# Altium schematic sheet RGBM-06.SchDoc
size Tabloid; SheetNumber: 6; SheetTotal: 7
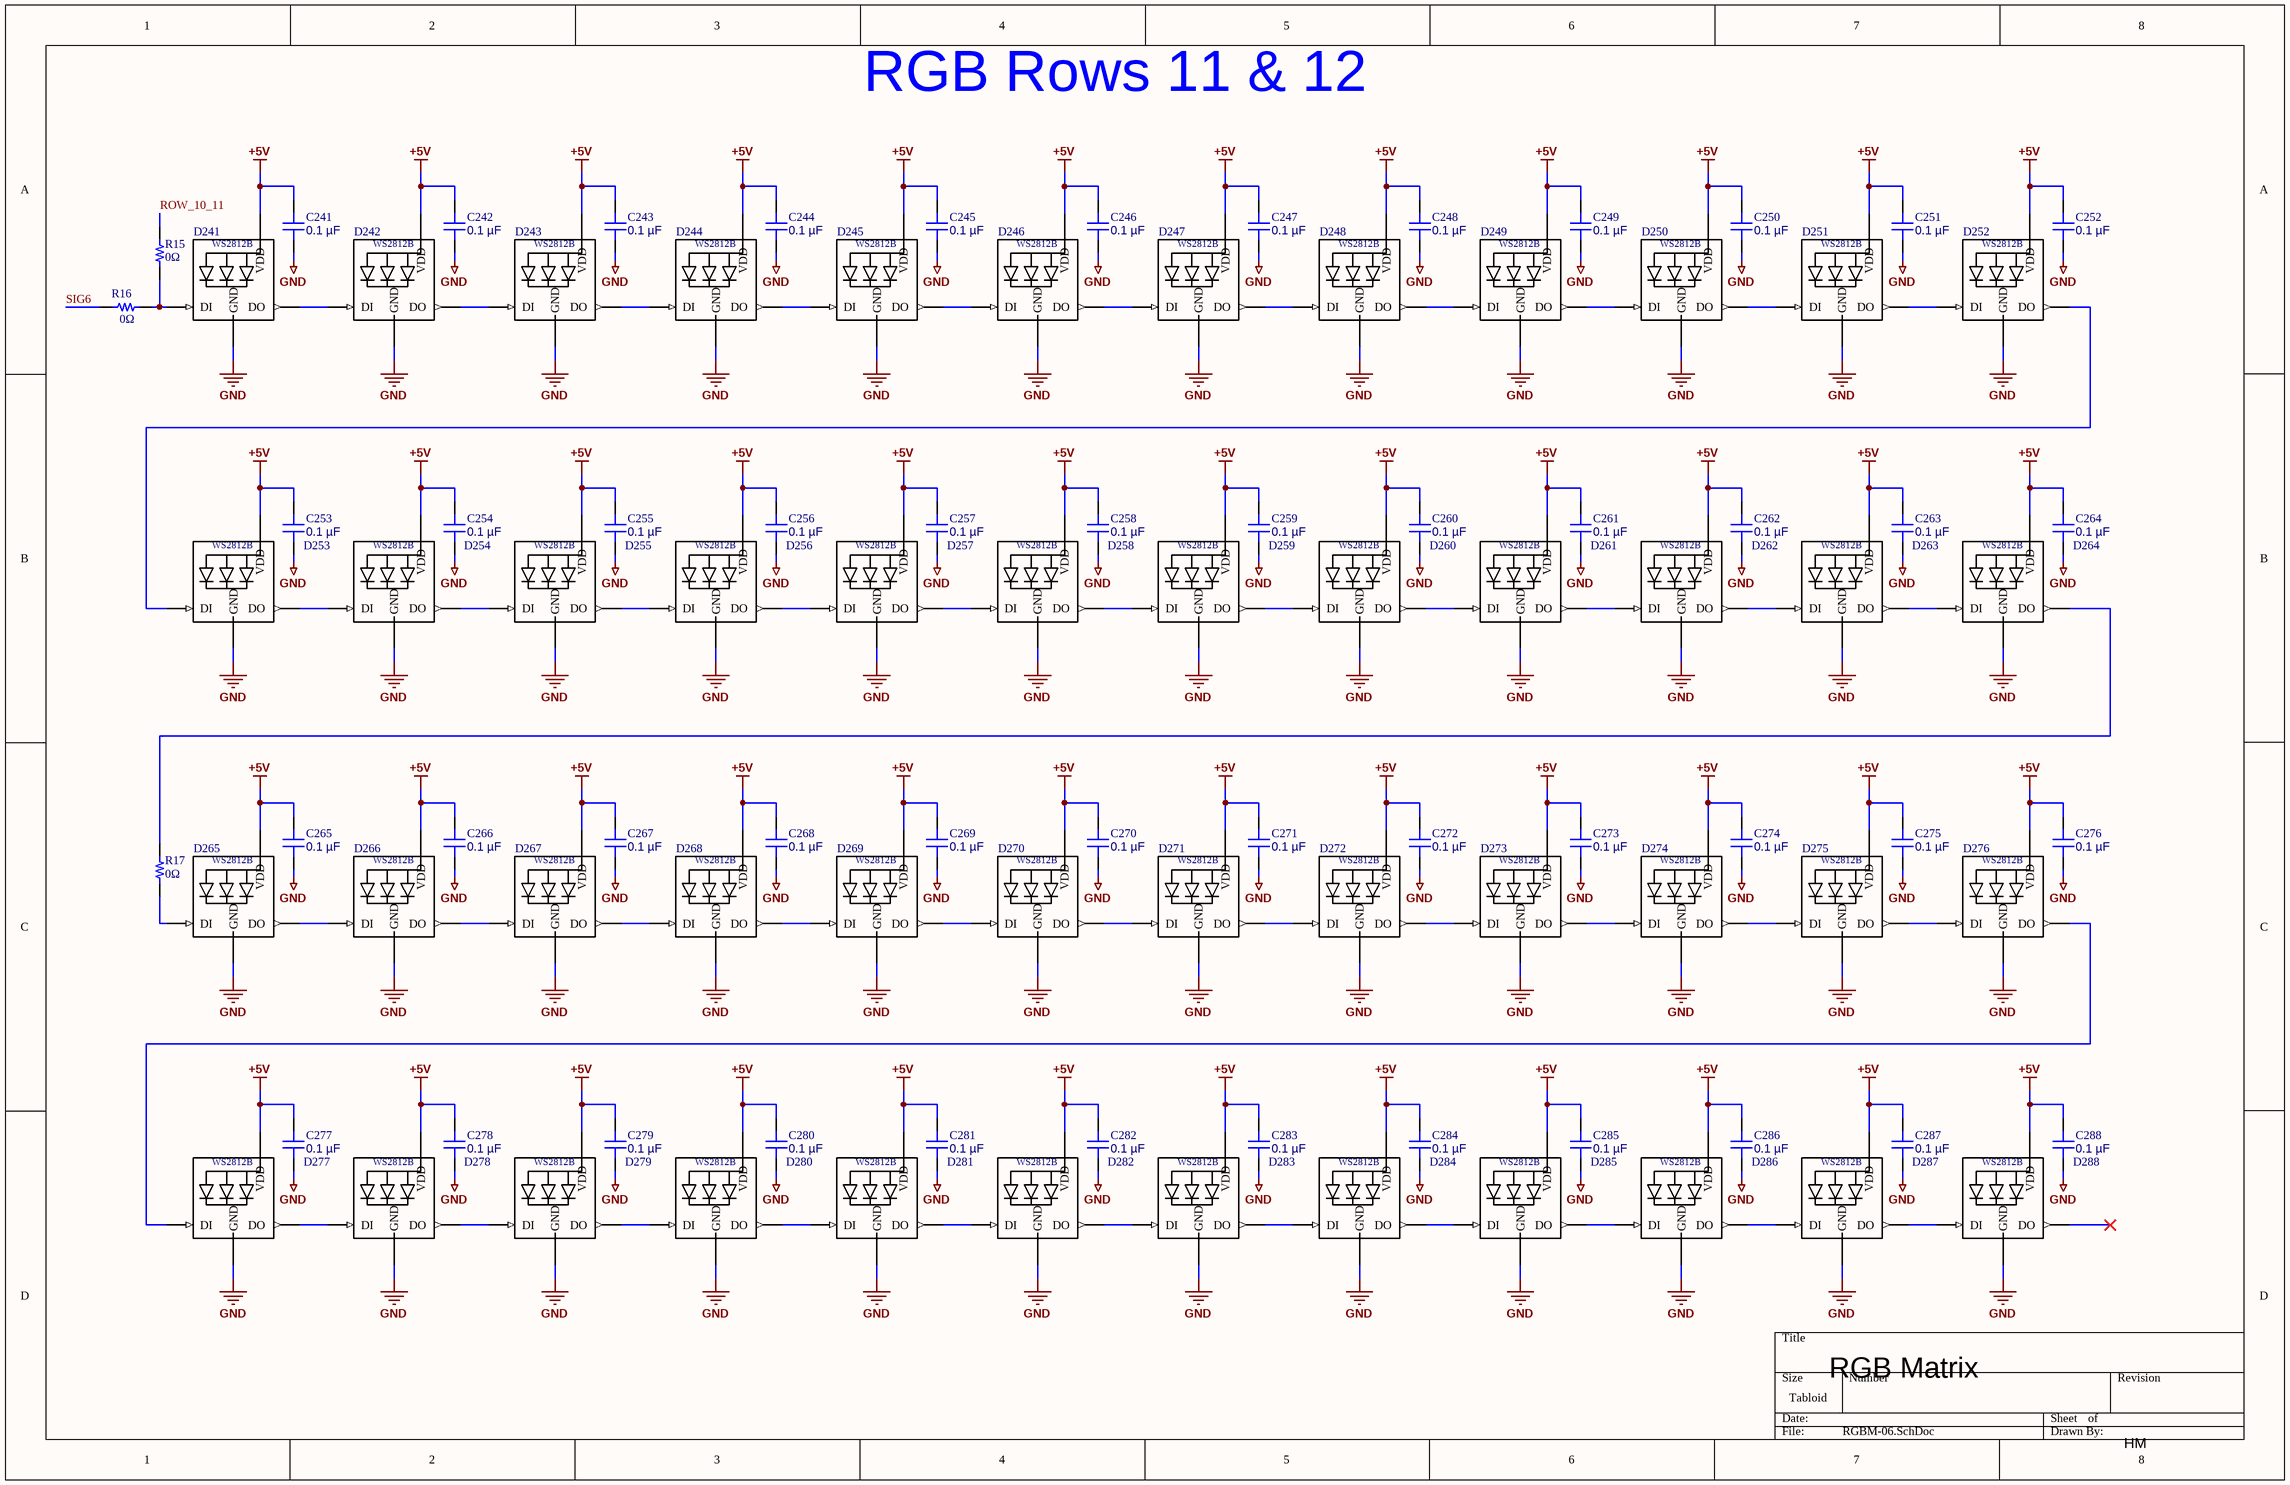
[diagram p0: RGBM-06.SchDoc]

## Parts
C241  0.1 µF  [CAP 0603_1608]
C242  0.1 µF  [CAP 0603_1608]
C243  0.1 µF  [CAP 0603_1608]
C244  0.1 µF  [CAP 0603_1608]
C245  0.1 µF  [CAP 0603_1608]
C246  0.1 µF  [CAP 0603_1608]
C247  0.1 µF  [CAP 0603_1608]
C248  0.1 µF  [CAP 0603_1608]
C249  0.1 µF  [CAP 0603_1608]
C250  0.1 µF  [CAP 0603_1608]
C251  0.1 µF  [CAP 0603_1608]
C252  0.1 µF  [CAP 0603_1608]
C253  0.1 µF  [CAP 0603_1608]
C254  0.1 µF  [CAP 0603_1608]
C255  0.1 µF  [CAP 0603_1608]
C256  0.1 µF  [CAP 0603_1608]
C257  0.1 µF  [CAP 0603_1608]
C258  0.1 µF  [CAP 0603_1608]
C259  0.1 µF  [CAP 0603_1608]
C260  0.1 µF  [CAP 0603_1608]
C261  0.1 µF  [CAP 0603_1608]
C262  0.1 µF  [CAP 0603_1608]
C263  0.1 µF  [CAP 0603_1608]
C264  0.1 µF  [CAP 0603_1608]
C265  0.1 µF  [CAP 0603_1608]
C266  0.1 µF  [CAP 0603_1608]
C267  0.1 µF  [CAP 0603_1608]
C268  0.1 µF  [CAP 0603_1608]
C269  0.1 µF  [CAP 0603_1608]
C270  0.1 µF  [CAP 0603_1608]
C271  0.1 µF  [CAP 0603_1608]
C272  0.1 µF  [CAP 0603_1608]
C273  0.1 µF  [CAP 0603_1608]
C274  0.1 µF  [CAP 0603_1608]
C275  0.1 µF  [CAP 0603_1608]
C276  0.1 µF  [CAP 0603_1608]
C277  0.1 µF  [CAP 0603_1608]
C278  0.1 µF  [CAP 0603_1608]
C279  0.1 µF  [CAP 0603_1608]
C280  0.1 µF  [CAP 0603_1608]
C281  0.1 µF  [CAP 0603_1608]
C282  0.1 µF  [CAP 0603_1608]
C283  0.1 µF  [CAP 0603_1608]
C284  0.1 µF  [CAP 0603_1608]
C285  0.1 µF  [CAP 0603_1608]
C286  0.1 µF  [CAP 0603_1608]
C287  0.1 µF  [CAP 0603_1608]
C288  0.1 µF  [CAP 0603_1608]
D241  WS2812B  [*WS2812B_WS2812B(Primary)]  (value not drawn)
D242  WS2812B  [*WS2812B_WS2812B(Primary)]  (value not drawn)
D243  WS2812B  [*WS2812B_WS2812B(Primary)]  (value not drawn)
D244  WS2812B  [*WS2812B_WS2812B(Primary)]  (value not drawn)
D245  WS2812B  [*WS2812B_WS2812B(Primary)]  (value not drawn)
D246  WS2812B  [*WS2812B_WS2812B(Primary)]  (value not drawn)
D247  WS2812B  [*WS2812B_WS2812B(Primary)]  (value not drawn)
D248  WS2812B  [*WS2812B_WS2812B(Primary)]  (value not drawn)
D249  WS2812B  [*WS2812B_WS2812B(Primary)]  (value not drawn)
D250  WS2812B  [*WS2812B_WS2812B(Primary)]  (value not drawn)
D251  WS2812B  [*WS2812B_WS2812B(Primary)]  (value not drawn)
D252  WS2812B  [*WS2812B_WS2812B(Primary)]  (value not drawn)
D253  WS2812B  [*WS2812B_WS2812B(Primary)]  (value not drawn)
D254  WS2812B  [*WS2812B_WS2812B(Primary)]  (value not drawn)
D255  WS2812B  [*WS2812B_WS2812B(Primary)]  (value not drawn)
D256  WS2812B  [*WS2812B_WS2812B(Primary)]  (value not drawn)
D257  WS2812B  [*WS2812B_WS2812B(Primary)]  (value not drawn)
D258  WS2812B  [*WS2812B_WS2812B(Primary)]  (value not drawn)
D259  WS2812B  [*WS2812B_WS2812B(Primary)]  (value not drawn)
D260  WS2812B  [*WS2812B_WS2812B(Primary)]  (value not drawn)
D261  WS2812B  [*WS2812B_WS2812B(Primary)]  (value not drawn)
D262  WS2812B  [*WS2812B_WS2812B(Primary)]  (value not drawn)
D263  WS2812B  [*WS2812B_WS2812B(Primary)]  (value not drawn)
D264  WS2812B  [*WS2812B_WS2812B(Primary)]  (value not drawn)
D265  WS2812B  [*WS2812B_WS2812B(Primary)]  (value not drawn)
D266  WS2812B  [*WS2812B_WS2812B(Primary)]  (value not drawn)
D267  WS2812B  [*WS2812B_WS2812B(Primary)]  (value not drawn)
D268  WS2812B  [*WS2812B_WS2812B(Primary)]  (value not drawn)
D269  WS2812B  [*WS2812B_WS2812B(Primary)]  (value not drawn)
D270  WS2812B  [*WS2812B_WS2812B(Primary)]  (value not drawn)
D271  WS2812B  [*WS2812B_WS2812B(Primary)]  (value not drawn)
D272  WS2812B  [*WS2812B_WS2812B(Primary)]  (value not drawn)
D273  WS2812B  [*WS2812B_WS2812B(Primary)]  (value not drawn)
D274  WS2812B  [*WS2812B_WS2812B(Primary)]  (value not drawn)
D275  WS2812B  [*WS2812B_WS2812B(Primary)]  (value not drawn)
D276  WS2812B  [*WS2812B_WS2812B(Primary)]  (value not drawn)
D277  WS2812B  [*WS2812B_WS2812B(Primary)]  (value not drawn)
D278  WS2812B  [*WS2812B_WS2812B(Primary)]  (value not drawn)
D279  WS2812B  [*WS2812B_WS2812B(Primary)]  (value not drawn)
D280  WS2812B  [*WS2812B_WS2812B(Primary)]  (value not drawn)
D281  WS2812B  [*WS2812B_WS2812B(Primary)]  (value not drawn)
D282  WS2812B  [*WS2812B_WS2812B(Primary)]  (value not drawn)
D283  WS2812B  [*WS2812B_WS2812B(Primary)]  (value not drawn)
D284  WS2812B  [*WS2812B_WS2812B(Primary)]  (value not drawn)
D285  WS2812B  [*WS2812B_WS2812B(Primary)]  (value not drawn)
D286  WS2812B  [*WS2812B_WS2812B(Primary)]  (value not drawn)
D287  WS2812B  [*WS2812B_WS2812B(Primary)]  (value not drawn)
D288  WS2812B  [*WS2812B_WS2812B(Primary)]  (value not drawn)
R15  0Ω  [RES 0603_1608]
R16  0Ω  [RES 0603_1608]
R17  0Ω  [RES 0603_1608]

## Nets
+5V: C241.2 C242.2 C243.2 C244.2 C245.2 C246.2 C247.2 C248.2 C249.2 C250.2 C251.2 C252.2 C253.2 C254.2 C255.2 C256.2 C257.2 C258.2 C259.2 C260.2 C261.2 C262.2 C263.2 C264.2 C265.2 C266.2 C267.2 C268.2 C269.2 C270.2 C271.2 C272.2 C273.2 C274.2 C275.2 C276.2 C277.2 C278.2 C279.2 C280.2 C281.2 C282.2 C283.2 C284.2 C285.2 C286.2 C287.2 C288.2 D241.1-VDD(VDD) D242.1-VDD(VDD) D243.1-VDD(VDD) D244.1-VDD(VDD) D245.1-VDD(VDD) D246.1-VDD(VDD) D247.1-VDD(VDD) D248.1-VDD(VDD) D249.1-VDD(VDD) D250.1-VDD(VDD) D251.1-VDD(VDD) D252.1-VDD(VDD) D253.1-VDD(VDD) D254.1-VDD(VDD) D255.1-VDD(VDD) D256.1-VDD(VDD) D257.1-VDD(VDD) D258.1-VDD(VDD) D259.1-VDD(VDD) D260.1-VDD(VDD) D261.1-VDD(VDD) D262.1-VDD(VDD) D263.1-VDD(VDD) D264.1-VDD(VDD) D265.1-VDD(VDD) D266.1-VDD(VDD) D267.1-VDD(VDD) D268.1-VDD(VDD) D269.1-VDD(VDD) D270.1-VDD(VDD) D271.1-VDD(VDD) D272.1-VDD(VDD) D273.1-VDD(VDD) D274.1-VDD(VDD) D275.1-VDD(VDD) D276.1-VDD(VDD) D277.1-VDD(VDD) D278.1-VDD(VDD) D279.1-VDD(VDD) D280.1-VDD(VDD) D281.1-VDD(VDD) D282.1-VDD(VDD) D283.1-VDD(VDD) D284.1-VDD(VDD) D285.1-VDD(VDD) D286.1-VDD(VDD) D287.1-VDD(VDD) D288.1-VDD(VDD)
GND: C241.1 C242.1 C243.1 C244.1 C245.1 C246.1 C247.1 C248.1 C249.1 C250.1 C251.1 C252.1 C253.1 C254.1 C255.1 C256.1 C257.1 C258.1 C259.1 C260.1 C261.1 C262.1 C263.1 C264.1 C265.1 C266.1 C267.1 C268.1 C269.1 C270.1 C271.1 C272.1 C273.1 C274.1 C275.1 C276.1 C277.1 C278.1 C279.1 C280.1 C281.1 C282.1 C283.1 C284.1 C285.1 C286.1 C287.1 C288.1 D241.3-GND(GND) D242.3-GND(GND) D243.3-GND(GND) D244.3-GND(GND) D245.3-GND(GND) D246.3-GND(GND) D247.3-GND(GND) D248.3-GND(GND) D249.3-GND(GND) D250.3-GND(GND) D251.3-GND(GND) D252.3-GND(GND) D253.3-GND(GND) D254.3-GND(GND) D255.3-GND(GND) D256.3-GND(GND) D257.3-GND(GND) D258.3-GND(GND) D259.3-GND(GND) D260.3-GND(GND) D261.3-GND(GND) D262.3-GND(GND) D263.3-GND(GND) D264.3-GND(GND) D265.3-GND(GND) D266.3-GND(GND) D267.3-GND(GND) D268.3-GND(GND) D269.3-GND(GND) D270.3-GND(GND) D271.3-GND(GND) D272.3-GND(GND) D273.3-GND(GND) D274.3-GND(GND) D275.3-GND(GND) D276.3-GND(GND) D277.3-GND(GND) D278.3-GND(GND) D279.3-GND(GND) D280.3-GND(GND) D281.3-GND(GND) D282.3-GND(GND) D283.3-GND(GND) D284.3-GND(GND) D285.3-GND(GND) D286.3-GND(GND) D287.3-GND(GND) D288.3-GND(GND)
ROW_10_11: R15.2
SIG6: R16.1
NetD241_2-DOUT: D241.2-DOUT(DO) D242.4-DIN(DI)
NetD241_4-DIN: D241.4-DIN(DI) R15.1 R16.2
NetD242_2-DOUT: D242.2-DOUT(DO) D243.4-DIN(DI)
NetD243_2-DOUT: D243.2-DOUT(DO) D244.4-DIN(DI)
NetD244_2-DOUT: D244.2-DOUT(DO) D245.4-DIN(DI)
NetD245_2-DOUT: D245.2-DOUT(DO) D246.4-DIN(DI)
NetD246_2-DOUT: D246.2-DOUT(DO) D247.4-DIN(DI)
NetD247_2-DOUT: D247.2-DOUT(DO) D248.4-DIN(DI)
NetD248_2-DOUT: D248.2-DOUT(DO) D249.4-DIN(DI)
NetD249_2-DOUT: D249.2-DOUT(DO) D250.4-DIN(DI)
NetD250_2-DOUT: D250.2-DOUT(DO) D251.4-DIN(DI)
NetD251_2-DOUT: D251.2-DOUT(DO) D252.4-DIN(DI)
NetD252_2-DOUT: D252.2-DOUT(DO) D253.4-DIN(DI)
NetD253_2-DOUT: D253.2-DOUT(DO) D254.4-DIN(DI)
NetD254_2-DOUT: D254.2-DOUT(DO) D255.4-DIN(DI)
NetD255_2-DOUT: D255.2-DOUT(DO) D256.4-DIN(DI)
NetD256_2-DOUT: D256.2-DOUT(DO) D257.4-DIN(DI)
NetD257_2-DOUT: D257.2-DOUT(DO) D258.4-DIN(DI)
NetD258_2-DOUT: D258.2-DOUT(DO) D259.4-DIN(DI)
NetD259_2-DOUT: D259.2-DOUT(DO) D260.4-DIN(DI)
NetD260_2-DOUT: D260.2-DOUT(DO) D261.4-DIN(DI)
NetD261_2-DOUT: D261.2-DOUT(DO) D262.4-DIN(DI)
NetD262_2-DOUT: D262.2-DOUT(DO) D263.4-DIN(DI)
NetD263_2-DOUT: D263.2-DOUT(DO) D264.4-DIN(DI)
NetD264_2-DOUT: D264.2-DOUT(DO) R17.2
NetD265_2-DOUT: D265.2-DOUT(DO) D266.4-DIN(DI)
NetD265_4-DIN: D265.4-DIN(DI) R17.1
NetD266_2-DOUT: D266.2-DOUT(DO) D267.4-DIN(DI)
NetD267_2-DOUT: D267.2-DOUT(DO) D268.4-DIN(DI)
NetD268_2-DOUT: D268.2-DOUT(DO) D269.4-DIN(DI)
NetD269_2-DOUT: D269.2-DOUT(DO) D270.4-DIN(DI)
NetD270_2-DOUT: D270.2-DOUT(DO) D271.4-DIN(DI)
NetD271_2-DOUT: D271.2-DOUT(DO) D272.4-DIN(DI)
NetD272_2-DOUT: D272.2-DOUT(DO) D273.4-DIN(DI)
NetD273_2-DOUT: D273.2-DOUT(DO) D274.4-DIN(DI)
NetD274_2-DOUT: D274.2-DOUT(DO) D275.4-DIN(DI)
NetD275_2-DOUT: D275.2-DOUT(DO) D276.4-DIN(DI)
NetD276_2-DOUT: D276.2-DOUT(DO) D277.4-DIN(DI)
NetD277_2-DOUT: D277.2-DOUT(DO) D278.4-DIN(DI)
NetD278_2-DOUT: D278.2-DOUT(DO) D279.4-DIN(DI)
NetD279_2-DOUT: D279.2-DOUT(DO) D280.4-DIN(DI)
NetD280_2-DOUT: D280.2-DOUT(DO) D281.4-DIN(DI)
NetD281_2-DOUT: D281.2-DOUT(DO) D282.4-DIN(DI)
NetD282_2-DOUT: D282.2-DOUT(DO) D283.4-DIN(DI)
NetD283_2-DOUT: D283.2-DOUT(DO) D284.4-DIN(DI)
NetD284_2-DOUT: D284.2-DOUT(DO) D285.4-DIN(DI)
NetD285_2-DOUT: D285.2-DOUT(DO) D286.4-DIN(DI)
NetD286_2-DOUT: D286.2-DOUT(DO) D287.4-DIN(DI)
NetD287_2-DOUT: D287.2-DOUT(DO) D288.4-DIN(DI)

Not connected (* = marked no-connect by the designer): D288 2-DOUT(DO)*

## Notes on the sheet
- RGB Rows 11 & 12
- RGB Matrix
- HM

## Library data of the parts
C241-C288 = C0603C104K5RAC7411: CAP CER 0.1UF 50V X7R 0603; manufacturer: KEMET; Tolerance: ±10%; Part Number: C0603C104K5RAC7411; Capacitance: 0.1 µF; Applications: Bypass, Decoupling; componentlink1description: Datasheet; componentlink1url: https://api.kemet.com/component-edge/download/datasheet/C0603C104K5RAC7411.pdf; componentlink2description: DigiKey Link; componentlink2url: https://www.digikey.com/en/products/detail/kemet/C0603C104K5RAC7411/3317013; Device Package: 0603 (1608 Metric); lastupdated: 2026-04-06 7:23:52 PM; Lifecycle Status: Active; Minimum Order: 1; Mounting Type: Surface Mount, MLCC; Operating Temperature: -55°C ~ 125°C; Package / Case: 0603 (1608 Metric); packaging: TapeAndReel; partid: 2233; Part Status: Active; price: 0.01; series: SMD Comm X7R; Size / Dimension: 0.063" L x 0.031" W (1.60mm x 0.80mm); Supplier 1: DigiKey; Supplier Part Number 1: 399-C0603C104K5RAC7411CT-ND; Temperature Coefficient: X7R; Thickness (Max): 0.035" (0.90mm); value: 0.1 µF; Voltage - Rated: 50V
D241-D288 = WS2812B: Intelligent control LED integrated light source; MF: Worldsemi; SnapEDA_Link: https://www.snapeda.com/parts/WS2812B/Worldsemi/view-part/?ref=snap; Package: None; MP: WS2812B; Check_prices: https://www.snapeda.com/parts/WS2812B/Worldsemi/view-part/?ref=eda; Value: *
R15-R17 = YJP1608-R001: RES SMD 0 OHM JUMPER 0603; Manufacturer: Susumu; Value: 0 Ohms; Part Number: YJP1608-R001; ComponentLink1Description: Datasheet; ComponentLink1URL: http://www.susumu.co.jp/common/pdf/n_catalog_partition10_en.pdf; ComponentLink2Description: DigiKey Link; ComponentLink2URL: https://www.digikey.com/en/products/detail/susumu/YJP1608-R001/2815047; Composition: Thin Film; Device Package: 0603 (1608 Metric); Height - Seated (Max): 0.016" (0.40mm); LastUpdated: 2024-02-09 8:42:50 PM; Lifecycle Status: Active; Minimum Order: 1; Number of Terminations: 2; Operating Temperature: -40°C ~ 125°C; Package / Case: 0603 (1608 Metric); Packaging: TapeAndReel; PartId: 16802; Part Status: Active; Price: 0.08; Resistance: 0 Ohms; Series: YJP; Size / Dimension: 0.063" L x 0.031" W (1.60mm x 0.80mm); Supplier 1: DigiKey; Supplier Part Number 1: 408-1515-1-ND; Supplier Device Package: 0603; Tolerance: Jumper